# EAGLE design preamp_duo (EAGLE 6.3)
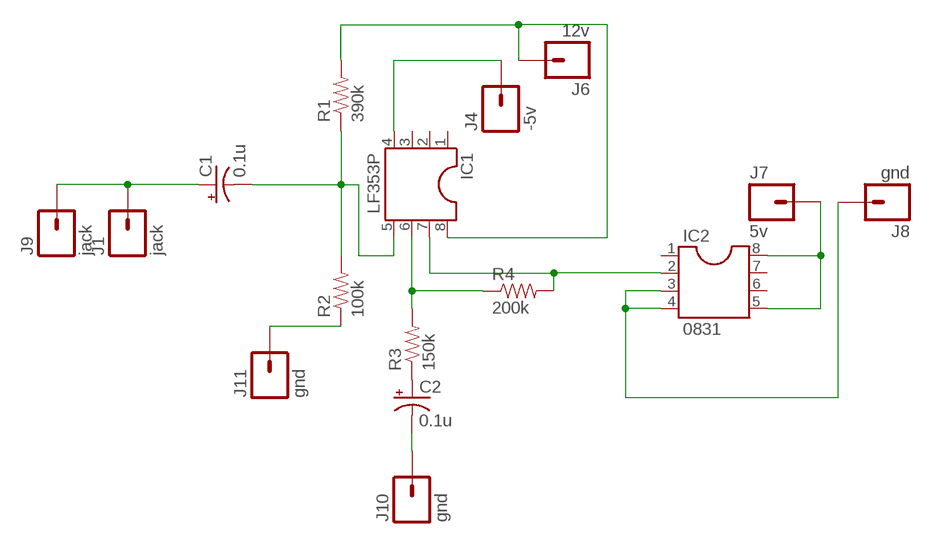
[diagram p0: schematic, sheet 1]

## Parts
C1  0.1u  CAP_POLPTH2  [CPOL-RADIAL-10UF-25V]
C2  0.1u  CAP_POLPTH2  [CPOL-RADIAL-10UF-25V]
IC1  LF353P  DIL8  [DIL08]
IC2  0831  DIL8  [DIL08]
J1  jack  M01PTH  [1X01]
J4  -5v  M01PTH  [1X01]
J6  12v  M01PTH  [1X01]
J7  5v  M01PTH  [1X01]
J8  gnd  M01PTH  [1X01]
J9  jack  M01PTH  [1X01]
J10  gnd  M01PTH  [1X01]
J11  gnd  M01PTH  [1X01]
R1  390k  RESISTORAXIAL-0.3  [AXIAL-0.3]
R2  100k  RESISTORAXIAL-0.3  [AXIAL-0.3]
R3  150k  RESISTORAXIAL-0.3  [AXIAL-0.3]
R4  200k  RESISTORAXIAL-0.3  [AXIAL-0.3]

## Nets
N$1: C1.2(-) IC1.5 R1.P$1 R2.P$2
N$2: C1.1(+) J1.1 J9.1
N$3: IC1.8 J6.1 R1.P$2
N$4: C2.1(+) R3.P$1
N$5: IC1.6 R3.P$2 R4.P$1
N$6: IC1.7 IC2.2 R4.P$2
N$7: IC1.4 J4.1
N$9: IC2.5 IC2.8 J7.1
N$10: J11.1 R2.P$1
N$11: IC2.3 IC2.4 J8.1
N$12: C2.2(-) J10.1
Unconnected: IC1.1 IC1.2 IC1.3 IC2.1 IC2.6 IC2.7

## Library data of the parts
C1 C2 = SparkFun-Capacitors:CAP_POL: Capacitor Polarized These are standard SMD and PTH capacitors. Normally 10uF, 47uF, and 100uF in electrolytic and tantalum varieties. Always verify the external diameter of the through hole cap, it varies with capacity, voltage, and manufacturer. The EIA devices should be standard.
IC1 IC2 = ic-package:DIL8: Dual In Line / Socket
J1 J4 J6-J11 = SparkFun-Connectors:M01: Header 1 Standard 1-pin 0.1" header. Use with straight break away headers (SKU : PRT-00116), right angle break away headers (PRT-00553), swiss pins (PRT-00743), machine pins (PRT-00117), and female headers (PRT-00115). SMTSO-256-ET is a "flush mount" nut for a 4-40 screw. The older package used to be too tight, and did not allow it to sit properly thru the drill hit. The latest (0.165DIA) fits nice and snug.
R1-R4 = SparkFun-Passives:RESISTOR: Resistor Basic schematic elements and footprints for 0603, 1206, and PTH resistors.

## Board
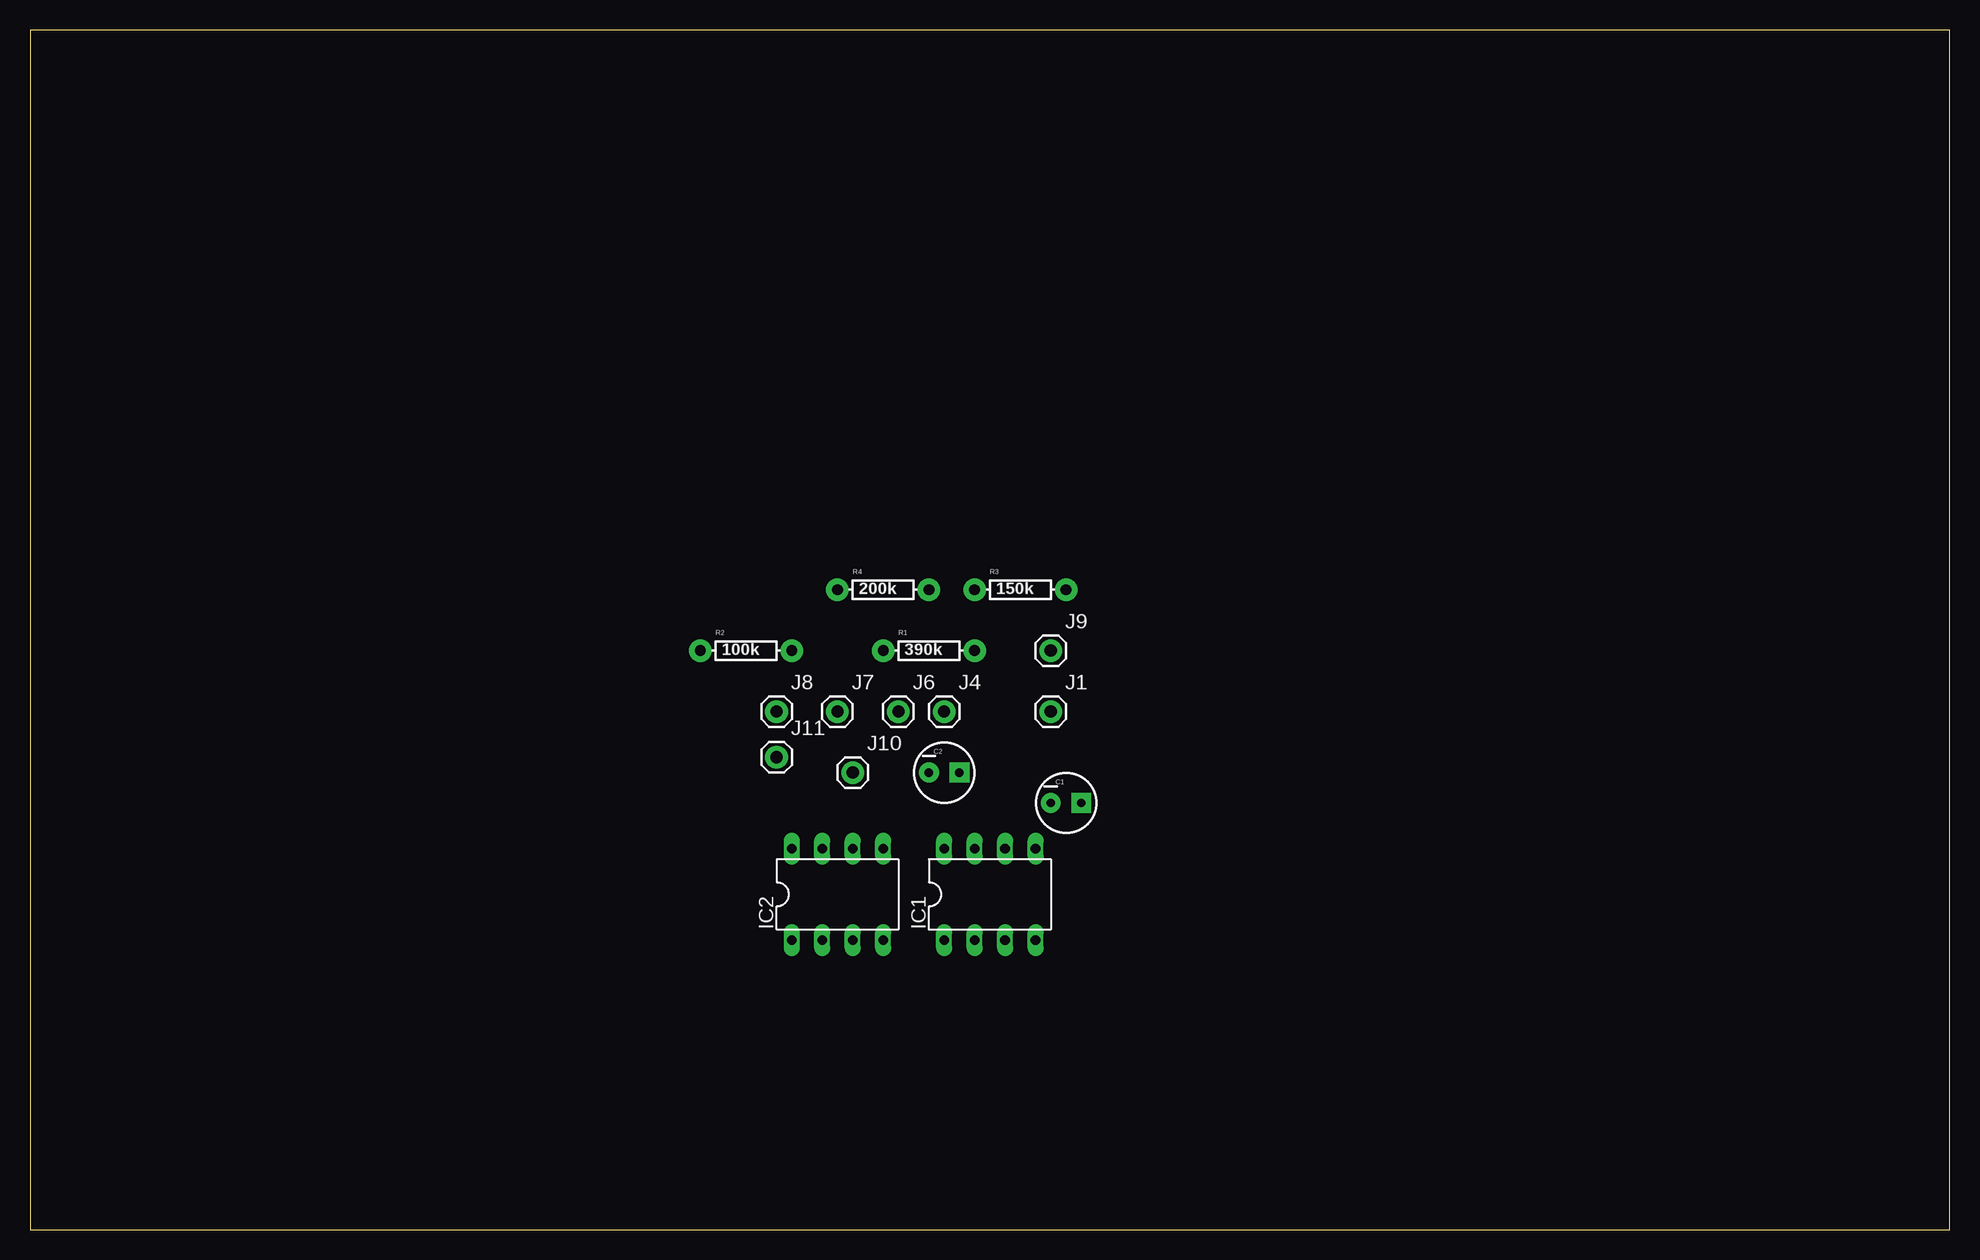
[diagram p1: board, top side]
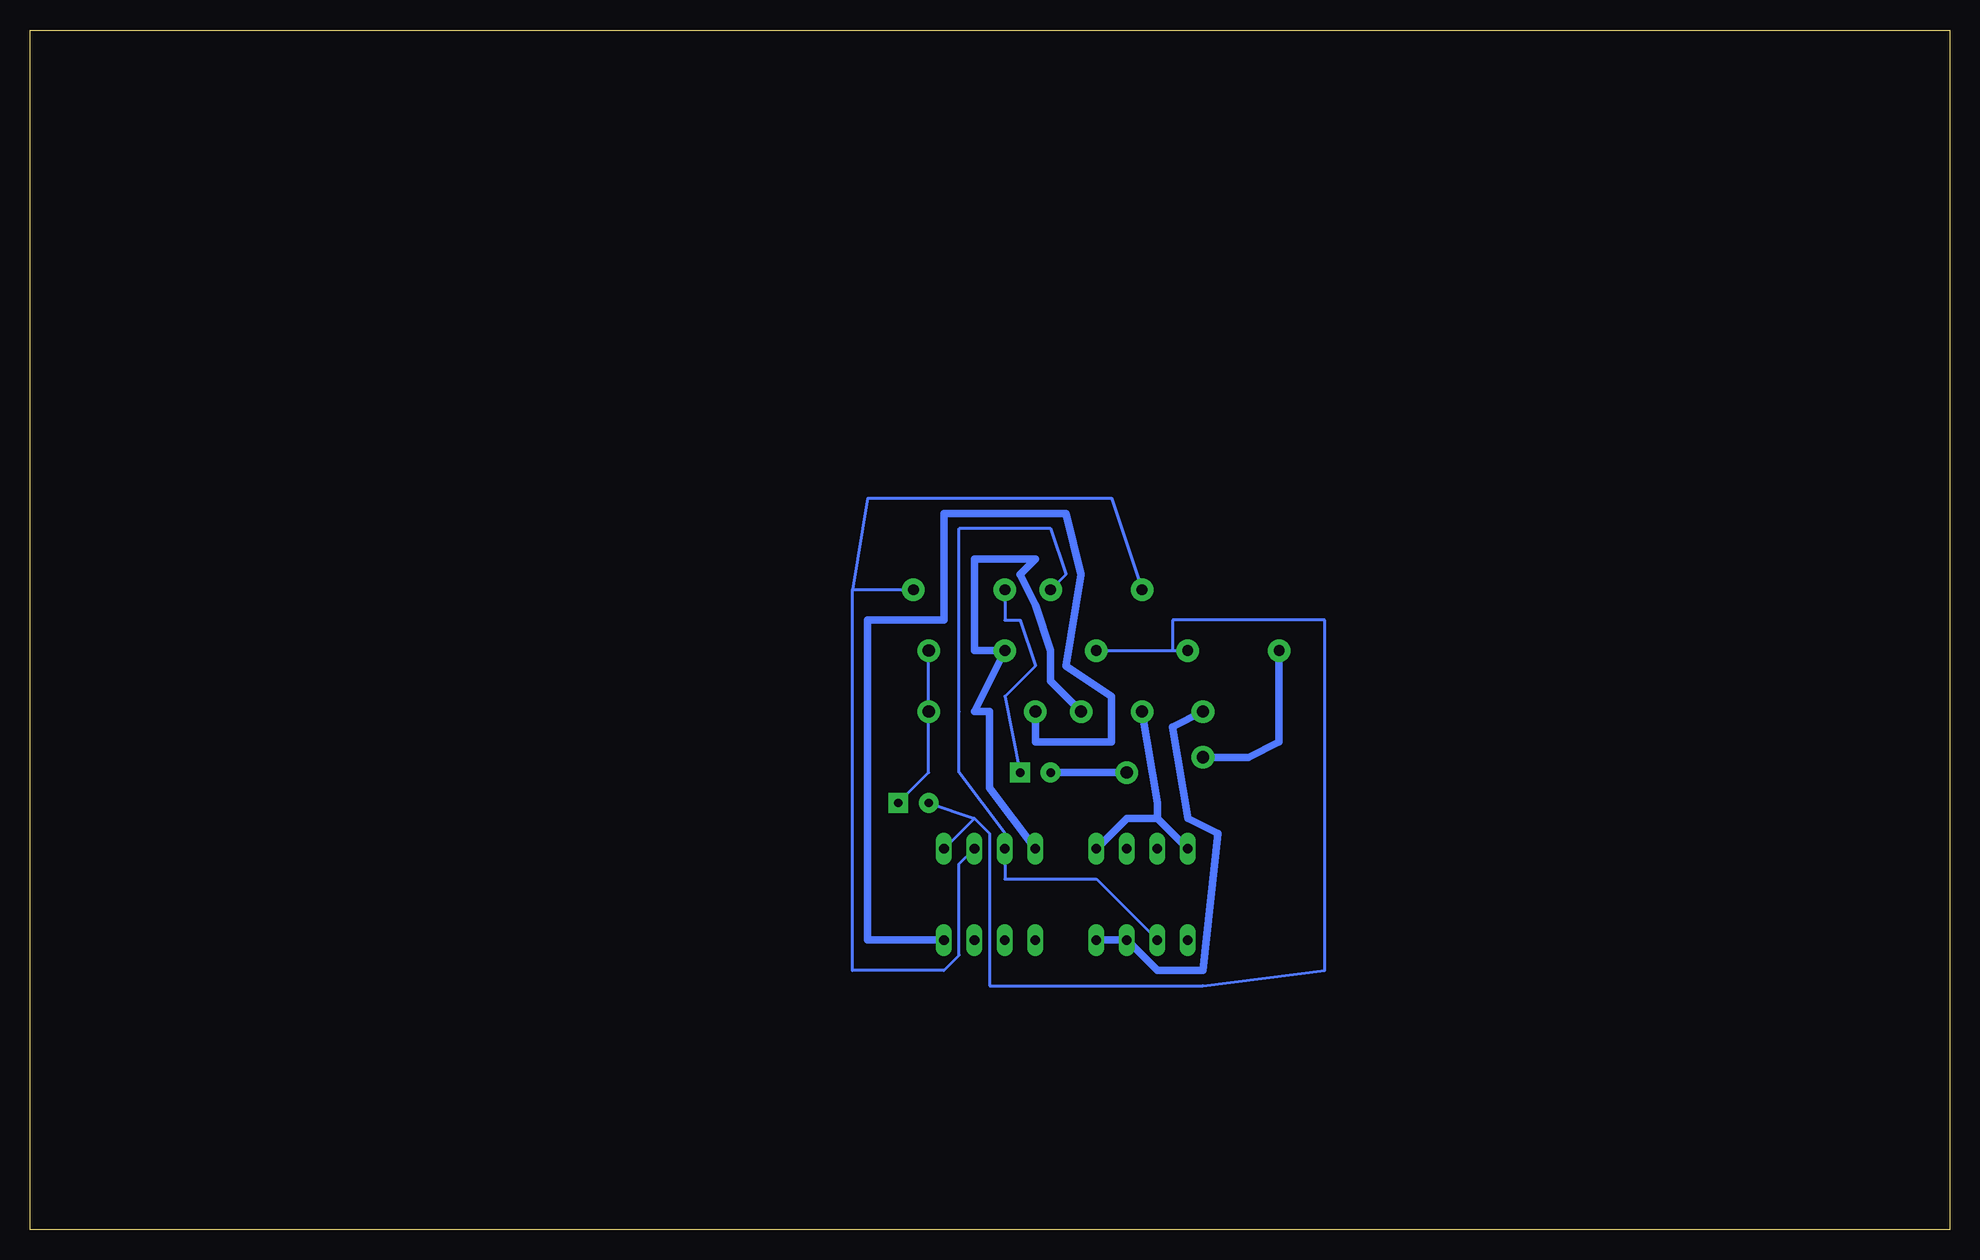
[diagram p2: board, bottom side, seen from below]

Size 160 x 100 mm. Coordinates in mm from the lower left corner, seen from the top.
Outline: 0,0 160,0 160,100 0,100 0,0
Copper layers (1*16): Top 0.035mm / dielectric 1.5mm / Bottom 0.035mm
Design rules "default *": minimum track width 10mil, minimum drill 24mil, track to track 12mil, track to pad 12mil, pad to pad 12mil, via to via 12mil, smd to smd 12mil, copper to edge 40mil, drill to drill 8mil, minimum pad ring 10mil, minimum via ring 8mil, stop-mask expansion 4mil, vias tented up to drill 0mil, thermal gap 10mil

### Footprints (pad centres in the part's own frame; a part is rotated, then mirrored left to right if it is on the bottom)
CPOL-RADIAL-10UF-25V = drill 0.7 pad 1.651 square: 1 1.27,0 | drill 0.7 pad 1.651: 2 -1.27,0
DIL08 = drill 0.813 long: 1 -3.81,-3.81; 2 -1.27,-3.81; 3 1.27,-3.81; 4 3.81,-3.81; 5 3.81,3.81; 6 1.27,3.81; 7 -1.27,3.81; 8 -3.81,3.81
1X01 = drill 1.016 pad 1.88: 1 0,0
AXIAL-0.3 = drill 0.9 pad 1.88: P$1 -3.81,0; P$2 3.81,0

### Placement (x,y rotation side)
C1  86.36,35.56 0 top
C2  76.2,38.1 0 top
IC1  80.01,27.94 0 top
IC2  67.31,27.94 0 top
J1  85.09,43.18 0 top
J4  76.2,43.18 0 top
J6  72.39,43.18 0 top
J7  67.31,43.18 0 top
J8  62.23,43.18 0 top
J9  85.09,48.26 0 top
J10  68.58,38.1 0 top
J11  62.23,39.37 0 top
R1  74.93,48.26 0 top
R2  59.69,48.26 0 top
R3  82.55,53.34 0 top
R4  71.12,53.34 0 top

### Tracks (layer width: path | path; a pad name or v marks a point on that pad's centre or on a via)
N$1
  Bottom 0.254: R1.P$1 R2.P$2 64.77,48.26 64.77,50.8 52.07,50.8 52.07,21.59 62.23,20.32 80.01,20.32 80.01,33.02 81.28,34.29 | 81.28,34.29 IC1.5 | C1.2 81.28,34.29
N$2
  Bottom 0.254: J9.1 J1.1 85.09,38.1 C1.1
N$3
  Bottom 0.61: IC1.8 80.01,36.83 80.01,43.18 81.28,43.18 R1.P$2 81.28,48.26 81.28,55.88 76.2,55.88 77.47,54.61 76.2,52.07 74.93,48.26 74.93,45.72 J6.1
N$4
  Bottom 0.254: C2.1 78.74,44.45 76.2,46.99 77.47,50.8 78.74,50.8 R3.P$1
N$5
  Bottom 0.254: IC1.6 82.55,30.48 82.55,22.86 83.82,21.59 91.44,21.59 91.44,53.34 | R4.P$1 69.85,60.96 90.17,60.96 91.44,53.34 | 91.44,53.34 R3.P$2
N$6
  Bottom 0.254: IC2.2 71.12,29.21 78.74,29.21 IC1.7 78.74,33.02 82.55,38.1 82.55,43.18 82.55,58.42 74.93,58.42 73.66,54.61 R4.P$2
N$7
  Bottom 0.61: J4.1 76.2,40.64 69.85,40.64 69.85,44.45 73.66,46.99 72.39,54.61 73.66,59.69 83.82,59.69 83.82,50.8 90.17,50.8 90.17,24.13 IC1.4
N$9
  Bottom 0.61: 66.04,34.29 66.04,35.56 J7.1 | 66.04,34.29 IC2.8 | IC2.5 68.58,34.29 66.04,34.29
N$10
  Bottom 0.61: J11.1 58.42,39.37 55.88,40.64 R2.P$1
N$11
  Bottom 0.61: IC2.4 IC2.3 66.04,21.59 62.23,21.59 60.96,33.02 63.5,34.29 64.77,41.91 J8.1
N$12
  Bottom 0.61: J10.1 C2.2